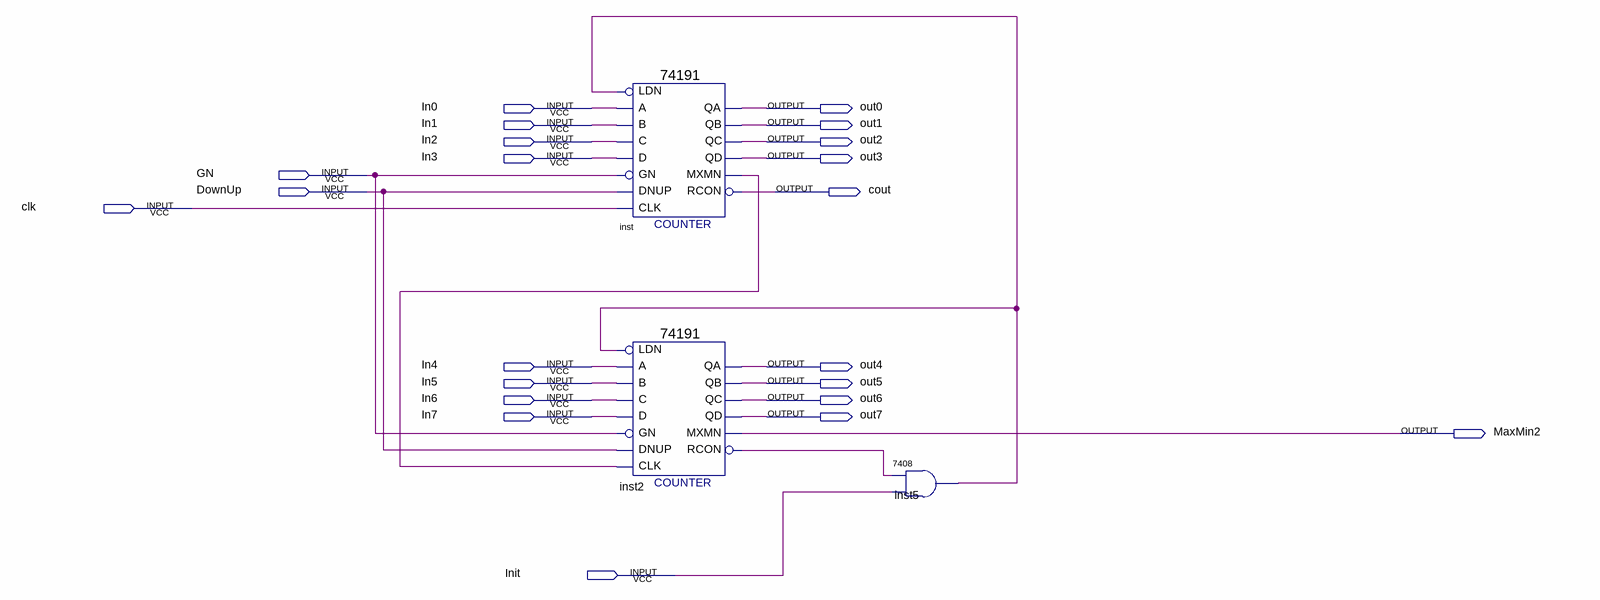
[diagram p0: schematic sheet]
// Quartus schematic CounterDivider.bdf as structural Verilog: 3 symbols, 22 pins
module CounterDivider (
  input  In0,
  input  In1,
  input  In2,
  input  In3,
  input  GN,
  input  DownUp,
  input  clk,
  input  In4,
  input  In5,
  input  In6,
  input  In7,
  input  Init,
  output out0,
  output out1,
  output out2,
  output out3,
  output cout,
  output out4,
  output out5,
  output out6,
  output out7,
  output MaxMin2
);

  wire inst2_rcon, inst5_1, inst_mxmn;

  \74191  inst (
    .LDN(inst5_1), .D(In3), .C(In2), .B(In1), .A(In0), .CLK(clk), .DNUP(DownUp), .GN(GN), .RCON(cout),
    .MXMN(inst_mxmn), .QA(out0), .QB(out1), .QD(out3), .QC(out2));
  \74191  inst2 (
    .LDN(inst5_1), .D(In7), .C(In6), .B(In5), .A(In4), .CLK(inst_mxmn), .DNUP(DownUp), .GN(GN),
    .RCON(inst2_rcon), .MXMN(MaxMin2), .QA(out4), .QB(out5), .QD(out7), .QC(out6));
  \7408  inst5 (.\3 (Init), .\2 (inst2_rcon), .\1 (inst5_1));
endmodule
